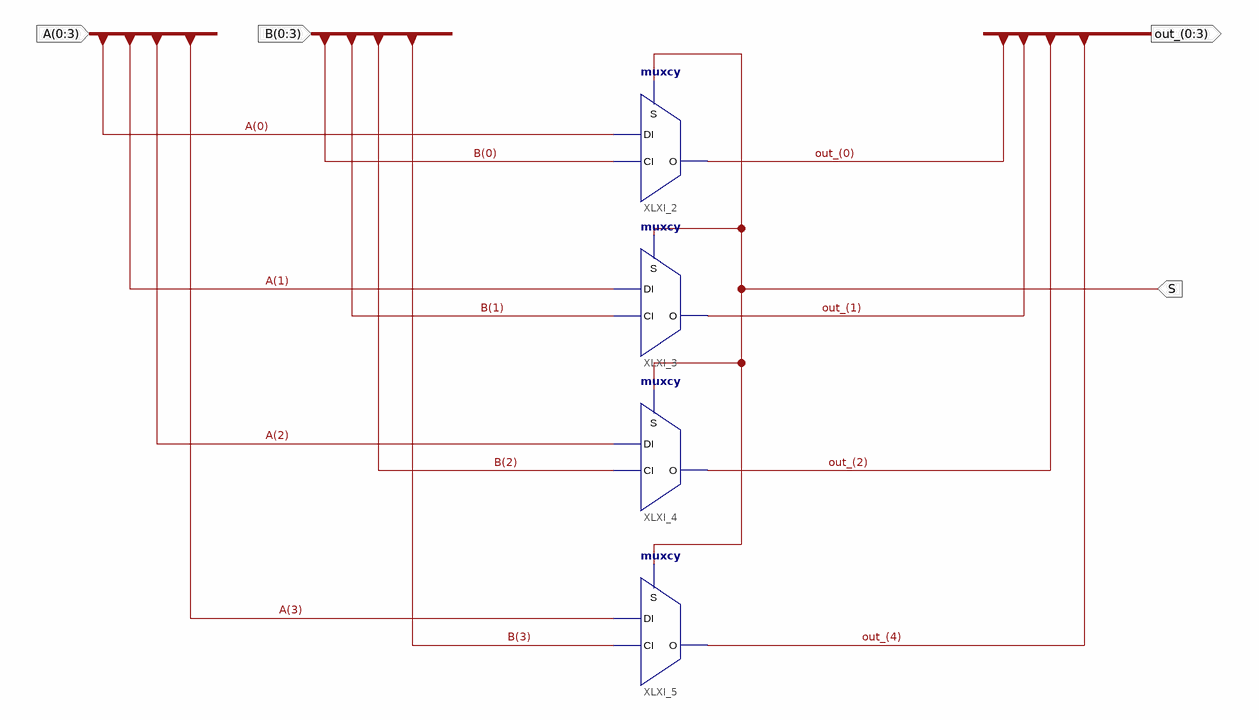
[diagram p0: schematic sheet 1]
// Xilinx ISE schematic bus.sch (artix7) as structural Verilog: 4 symbols, 4 ports
module bus (
  input  [0:3] B,
  input  [0:3] A,
  input  S,
  output [0:4] out_
);

  muxcy XLXI_2 (.CI(B[0]), .DI(A[0]), .S(S), .O(out_[0]));
  muxcy XLXI_3 (.CI(B[1]), .DI(A[1]), .S(S), .O(out_[1]));
  muxcy XLXI_4 (.CI(B[2]), .DI(A[2]), .S(S), .O(out_[2]));
  muxcy XLXI_5 (.CI(B[3]), .DI(A[3]), .S(S), .O(out_[4]));
endmodule
